# EAGLE schematic breakout (EAGLE 9.4.0)

## Sheet 1 of 2
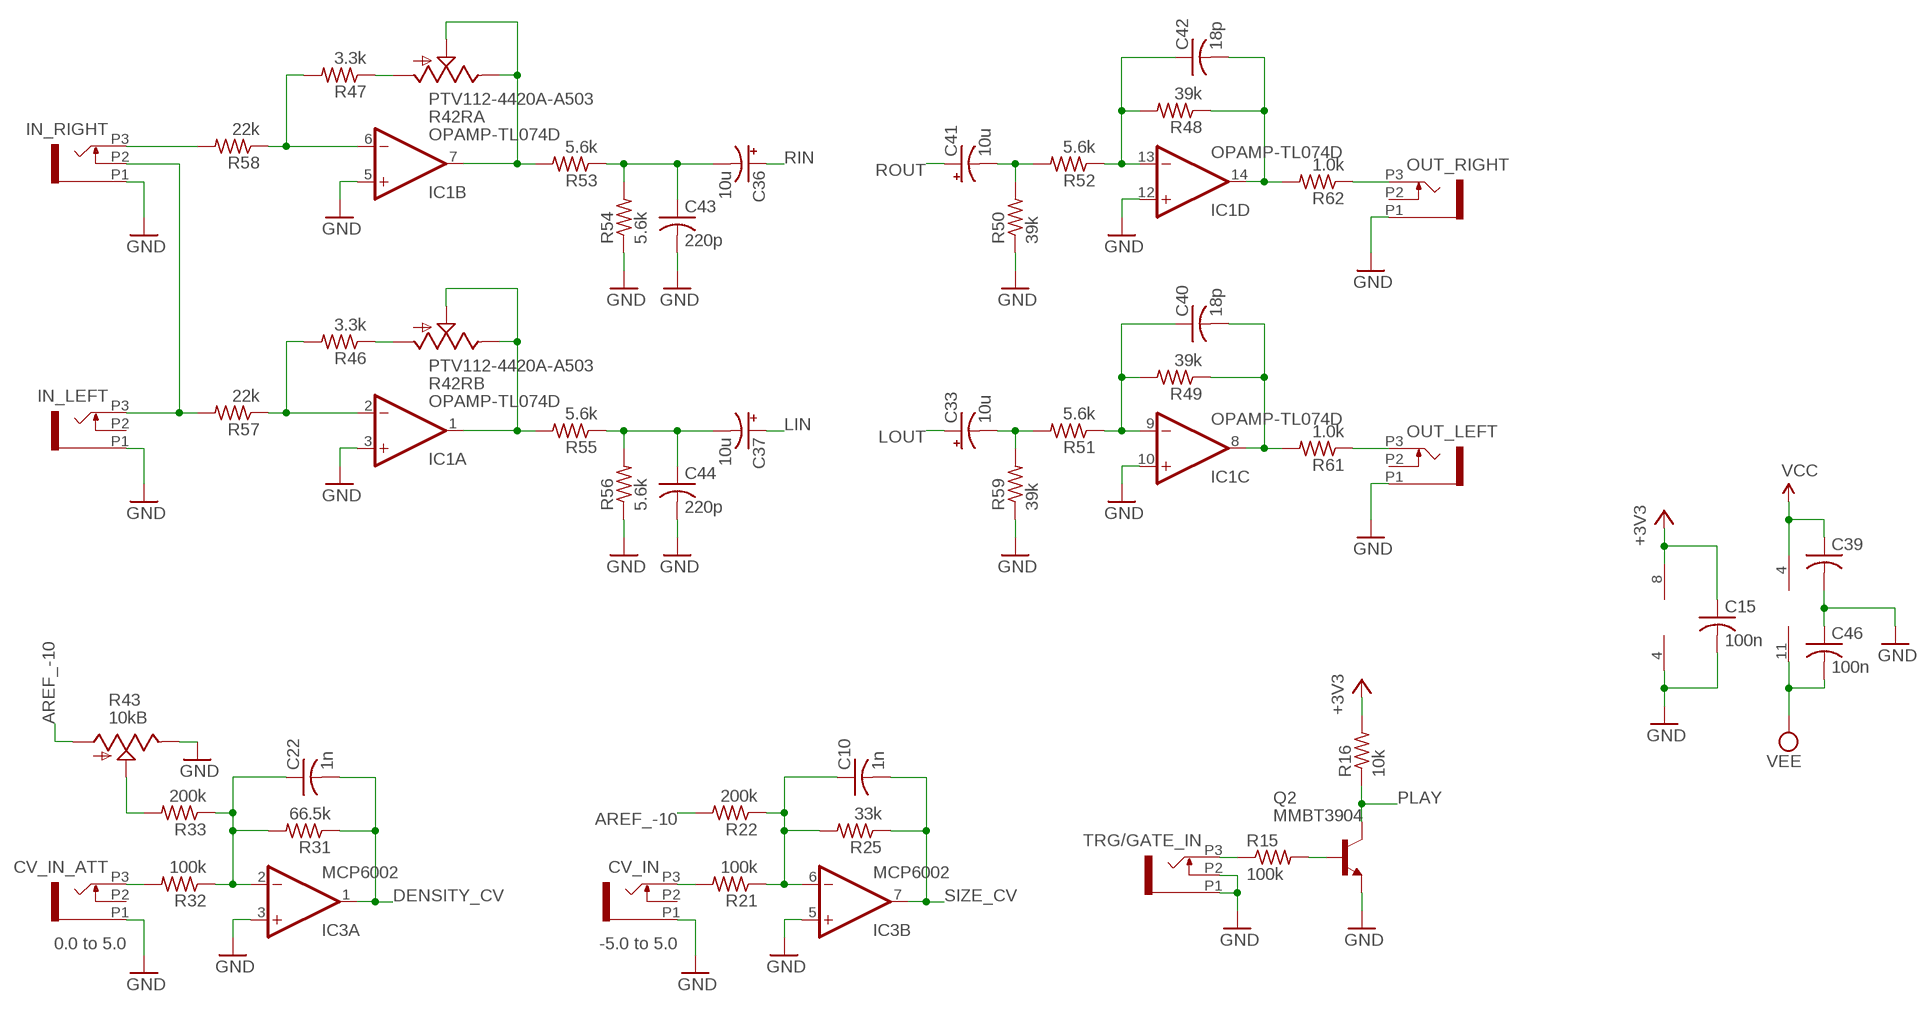
[diagram p0: schematic, sheet 1]

### Parts
C10  1n  C-USC0603  [C0603]
C15  100n  C-USC0603  [C0603]
C22  1n  C-USC0603  [C0603]
C33  10u  CPOL-USB  [PANASONIC_B]
C36  10u  CPOL-USB  [PANASONIC_B]
C37  10u  CPOL-USB  [PANASONIC_B]
C39  100n  C-USC0603  [C0603]
C40  18p  C-USC0603  [C0603]
C41  10u  CPOL-USB  [PANASONIC_B]
C42  18p  C-USC0603  [C0603]
C43  220p  C-USC0603  [C0603]
C44  220p  C-USC0603  [C0603]
C46  100n  C-USC0603  [C0603]
CV_IN  PJ301_THONKICONN6  [WQP_PJ_301M6]
CV_IN_ATT  PJ301_THONKICONN6  [WQP_PJ_301M6]
IC1  OPAMP-TL074D  [SO14]
IC3  MCP6002  TL072D  [SO08]
IN_LEFT  PJ301_THONKICONN6  [WQP_PJ_301M6]
IN_RIGHT  PJ301_THONKICONN6  [WQP_PJ_301M6]
OUT_LEFT  PJ301_THONKICONN6  [WQP_PJ_301M6]
OUT_RIGHT  PJ301_THONKICONN6  [WQP_PJ_301M6]
Q2  MMBT3904  MMBT3904LT1-NPN-SOT23-BEC  [SOT23-BEC]
R15  100k  R-US_R0603  [R0603]
R16  10k  R-US_R0603  [R0603]
R21  100k  R-US_R0603  [R0603]
R22  200k  R-US_R0603  [R0603]
R25  33k  R-US_R0603  [R0603]
R31  66.5k  R-US_R0603  [R0603]
R32  100k  R-US_R0603  [R0603]
R33  200k  R-US_R0603  [R0603]
R42  PTV112-4420A-A503  POT_US_DUAL_GANG  [BOURNS_PTV112]
R43  10kB  POT_USVERTICAL_PS  [ALPS_POT_VERTICAL_PS]
R46  3.3k  R-US_R0603  [R0603]
R47  3.3k  R-US_R0603  [R0603]
R48  39k  R-US_R0603  [R0603]
R49  39k  R-US_R0603  [R0603]
R50  39k  R-US_R0603  [R0603]
R51  5.6k  R-US_R0603  [R0603]
R52  5.6k  R-US_R0603  [R0603]
R53  5.6k  R-US_R0603  [R0603]
R54  5.6k  R-US_R0603  [R0603]
R55  5.6k  R-US_R0603  [R0603]
R56  5.6k  R-US_R0603  [R0603]
R57  22k  R-US_R0603  [R0603]
R58  22k  R-US_R0603  [R0603]
R59  39k  R-US_R0603  [R0603]
R61  1.0k  R-US_R0603  [R0603]
R62  1.0k  R-US_R0603  [R0603]
TRG/GATE_IN  PJ301_THONKICONN6  [WQP_PJ_301M6]

### Nets
+3V3: C15.1 IC3.8(P:V+) R16.2 ; also sheet 2
AREF_-10: R22.2 R43.P$3(A) ; also sheet 2
DENSITY_CV: C22.2 IC3.1(A:OUT) R31.1
GND: C15.2 C39.2 C43.2 C44.2 C46.1 CV_IN.P1 CV_IN_ATT.P1 IC1.3(A:+IN) IC1.5(B:+IN) IC1.10(C:+IN) IC1.12(D:+IN) IC3.3(A:+IN) IC3.4(P:V-) IC3.5(B:+IN) IN_LEFT.P1 IN_RIGHT.P1 OUT_LEFT.P1 OUT_RIGHT.P1 Q2.E R43.P$1(E) R50.1 R54.1 R56.1 R59.1 TRG/GATE_IN.P1 TRG/GATE_IN.P2 ; also sheet 2
LIN: C37.+
LOUT: C33.+
LOUT_JACK: OUT_LEFT.P3 R61.1
N$1: CV_IN.P3 R21.2
N$2: C10.1 IC3.6(B:-IN) R21.1 R22.1 R25.2
N$14: CV_IN_ATT.P3 R32.2
N$18: C37.- C44.1 R55.1 R56.2
N$20: IN_RIGHT.P3 R58.2
N$21: IN_LEFT.P3 IN_RIGHT.P2 R57.2
N$22: C36.- C43.1 R53.1 R54.2
N$23: C41.- R50.2 R52.2
N$24: C22.1 IC3.2(A:-IN) R31.2 R32.1 R33.1
N$25: C42.1 IC1.13(D:-IN) R48.2 R52.1
N$26: R33.2 R43.P$2(S)
N$28: C42.2 IC1.14(D:OUT) R48.1 R62.2
N$31: C33.- R51.2 R59.2
N$32: C40.1 IC1.9(C:-IN) R49.2 R51.1
N$33: C40.2 IC1.8(C:OUT) R49.1 R61.2
N$36: R15.1 TRG/GATE_IN.P3
N$37: Q2.B R15.2
N$42: IC1.7(B:OUT) R42.2P(RA:S) R42.3P(RA:E) R53.2
N$51: IC1.1(A:OUT) R42.2(RB:S) R42.3(RB:E) R55.2
N$52: R42.1P(RA:A) R47.1
N$53: R42.1(RB:A) R46.1
N$54: IC1.6(B:-IN) R47.2 R58.1
N$58: IC1.2(A:-IN) R46.2 R57.1
PLAY: Q2.C R16.1
RIN: C36.+
ROUT: C41.+
ROUT_JACK: OUT_RIGHT.P3 R62.1
SIZE_CV: C10.2 IC3.7(B:OUT) R25.1
VCC: C39.1 IC1.4(P:V+) ; also sheet 2
VEE: C46.2 IC1.11(P:V-) ; also sheet 2
Unconnected: CV_IN.P2 CV_IN_ATT.P2 IN_LEFT.P2 OUT_LEFT.P2 OUT_RIGHT.P2

### Notes on the sheet
- 0.0 to 5.0 | -5.0 to 5.0

## Sheet 2 of 2
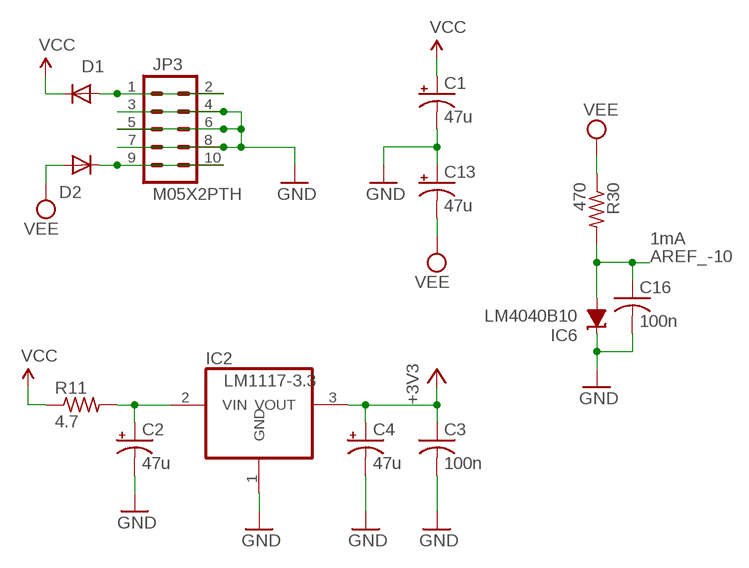
[diagram p1: schematic, sheet 2]

### Parts
C1  47u  CPOL-USD  [PANASONIC_D]
C2  47u  CPOL-USD  [PANASONIC_D]
C3  100n  C-USC0603  [C0603]
C4  47u  CPOL-USD  [PANASONIC_D]
C13  47u  CPOL-USD  [PANASONIC_D]
C16  100n  C-USC0603  [C0603]
D1  1N5819HW  DIODE-SOD123  [SOD123]
D2  1N5819HW  DIODE-SOD123  [SOD123]
IC2  LM1117-3.3  REG1117T  [TO252]
IC6  LM4040B10  LM4041B12DBZ  [DBZ_R-PDSO-G3]
JP3  M05X2PTH  [AVR_ICSP]
R11  4.7  R-US_R1206  [R1206]
R30  470  R-US_R0603  [R0603]

### Nets
+3V3: C3.1 C4.+ IC2.3(VOUT) ; also sheet 1
AREF_-10: C16.1 IC6.2(A) R30.2 ; also sheet 1
GND: C1.- C2.- C3.2 C4.- C13.+ C16.2 IC2.1(GND) IC6.1(C) JP3.3 JP3.4 JP3.5 JP3.6 JP3.7 JP3.8 ; also sheet 1
N$55: C2.+ IC2.2(VIN) R11.2
N$56: D1.A JP3.1 JP3.2
N$64: D2.C JP3.9 JP3.10
VCC: C1.+ D1.C R11.1 ; also sheet 1
VEE: C13.- D2.A R30.1 ; also sheet 1

### Notes on the sheet
- 1mA

## Library data of the parts
C1 C2 C4 C13 C33 C36 C37 C41 = rcl:CPOL-US: POLARIZED CAPACITOR, American symbol
C3 C10 C15 C16 C22 C39 C40 C42-C44 C46 = rcl:C-US: CAPACITOR, American symbol
CV_IN CV_IN_ATT IN_LEFT IN_RIGHT OUT_LEFT OUT_RIGHT TRG/GATE_IN = og-pj301:PJ301_THONKICONN
D1 D2 = diode:DIODE-: DIODE
IC1 = 0000-master:OPAMP-TL074: OP AMP
IC2 = og-vreg:REG1117: 800mA and 1A Low Dropout (LDO) Positive Regulator 1.8V, 2.5V, 2.85V, 3.3V, 5V, and Adj
IC3 = gm-ics:TL072: OP AMP
IC6 = texas:LM4041: PRECISION MICROPOWER SHUNT VOLTAGE REFERENCE Source: http://focus.ti.com/lit/ds/slcs146e/slcs146e.pdf
JP3 = og-header:M05X2: Header 5x2 Standard 10-pin dual row 0.1" header. Commonly used with AVR-ISP. Use with Spark Fun Electronics SKU: PRT-00778
Q2 = transistor:*-NPN-: NPN Transistror BF959 corrected 2008.03.06
R11 R15 R16 R21 R22 R25 R30-R33 R46-R59 R61 R62 = rcl:R-US_: RESISTOR, American symbol
R42 = og-pots:POT_US_DUAL_GANG
R43 = og-pots:POT_US